# Altium schematic sheet Trackpoint Amplifier.SchDoc
size B
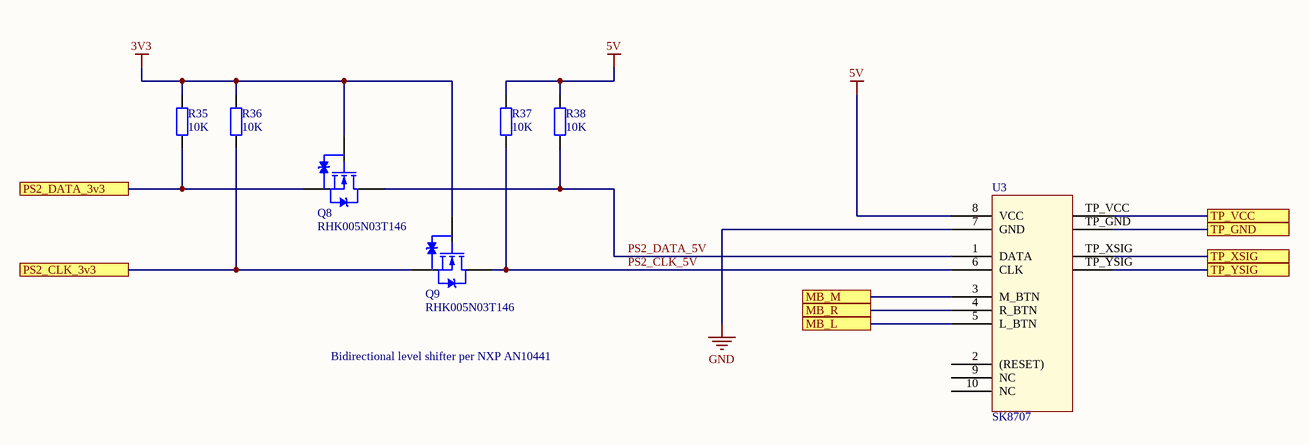
[diagram p0: Trackpoint Amplifier.SchDoc]

## Parts
Q8  RHK005N03T146  [RHK005N03T146 - SOT95P280X110-3N]
Q9  RHK005N03T146  [RHK005N03T146 - SOT95P280X110-3N]
R35  10K  [RES_SM0603_YAGEORC_N]
R36  10K  [RES_SM0603_YAGEORC_N]
R37  10K  [RES_SM0603_YAGEORC_N]
R38  10K  [RES_SM0603_YAGEORC_N]
U3  SK8707  [SK8707]

## Ports
MB_L, MB_M, MB_R, PS2_CLK_3v3, PS2_DATA_3v3, TP_GND, TP_VCC, TP_XSIG, TP_YSIG

## Nets
3V3: Q8.2(G) Q9.2(G) R35.2 R36.2
5V: R37.2 R38.2 U3.8(VCC)
GND: U3.7(GND)
MB_L: U3.5(L_BTN) ; port MB_L
MB_M: U3.3(M_BTN) ; port MB_M
MB_R: U3.4(R_BTN) ; port MB_R
PS2_CLK_3v3: Q9.1(S) R36.1 ; port PS2_CLK_3v3
PS2_CLK_5V: Q9.3(D) R37.1 U3.6(CLK)
PS2_DATA_3v3: Q8.1(S) R35.1 ; port PS2_DATA_3v3
PS2_DATA_5V: Q8.3(D) R38.1 U3.1(DATA)
TP_GND: U3.TP_GND ; port TP_GND
TP_VCC: U3.TP_VCC ; port TP_VCC
TP_XSIG: U3.TP_XSIG ; port TP_XSIG
TP_YSIG: U3.TP_YSIG ; port TP_YSIG

Not connected (* = marked no-connect by the designer): U3 2((RESET)) 9(NC) 10(NC)

## Notes on the sheet
- Bidirectional level shifter per NXP AN10441

## Library data of the parts
Q8 Q9 = RHK005N03T146: MOSFET N-CH 30V 500MA
R35-R38 = RC0603FR-0710KL: RES 10K SM0603 YAGEO RC_L; Power (Watts): 0.1; Resistance (Ohms): 10000; Tolerance (%): 1; Value: 10K; Category: Resistor; Manufacturer: Yageo; Manufacturer Part Number: RC0603FR-0710KL; Package: 0603; Supplier Part Number 1: 9238603; Supplier 1: Farnell; ComponentLink1URL: http://www.yageo.com; ComponentLink1Description: Manufacturer Website; Supplier 2: Digi-Key; Supplier Part Number 2: 311-10.0KHRCT-ND